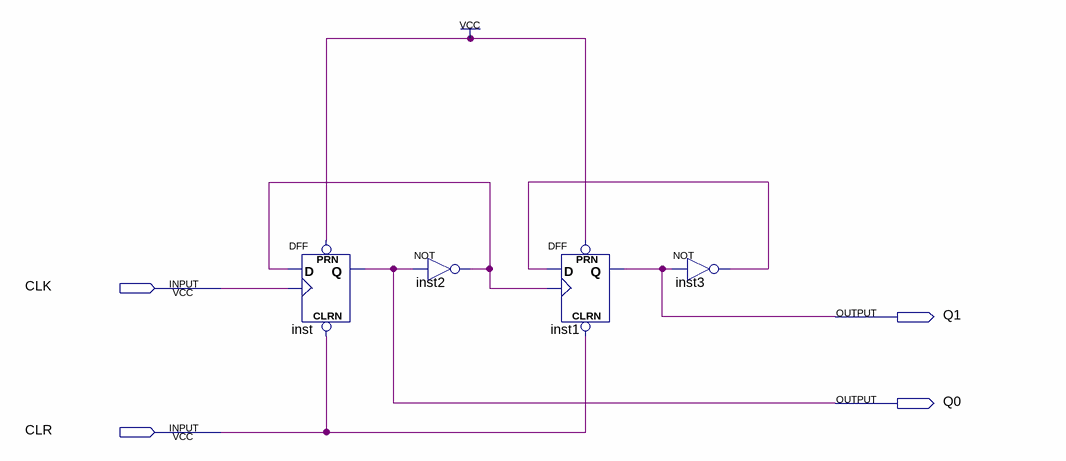
[diagram p0: schematic sheet]
// Quartus schematic counter.bdf as structural Verilog: 4 symbols, 4 pins
module counter (
  input  CLK,
  input  CLR,
  output Q1,
  output Q0
);

  wire inst2_out, inst3_out;

  DFF inst (.CLRN(CLR), .CLK(CLK), .D(inst2_out), .PRN(1'b1), .Q(Q0));
  not inst2 (inst2_out, Q0);
  DFF inst1 (.CLRN(CLR), .CLK(inst2_out), .D(inst3_out), .PRN(1'b1), .Q(Q1));
  not inst3 (inst3_out, Q1);
endmodule
